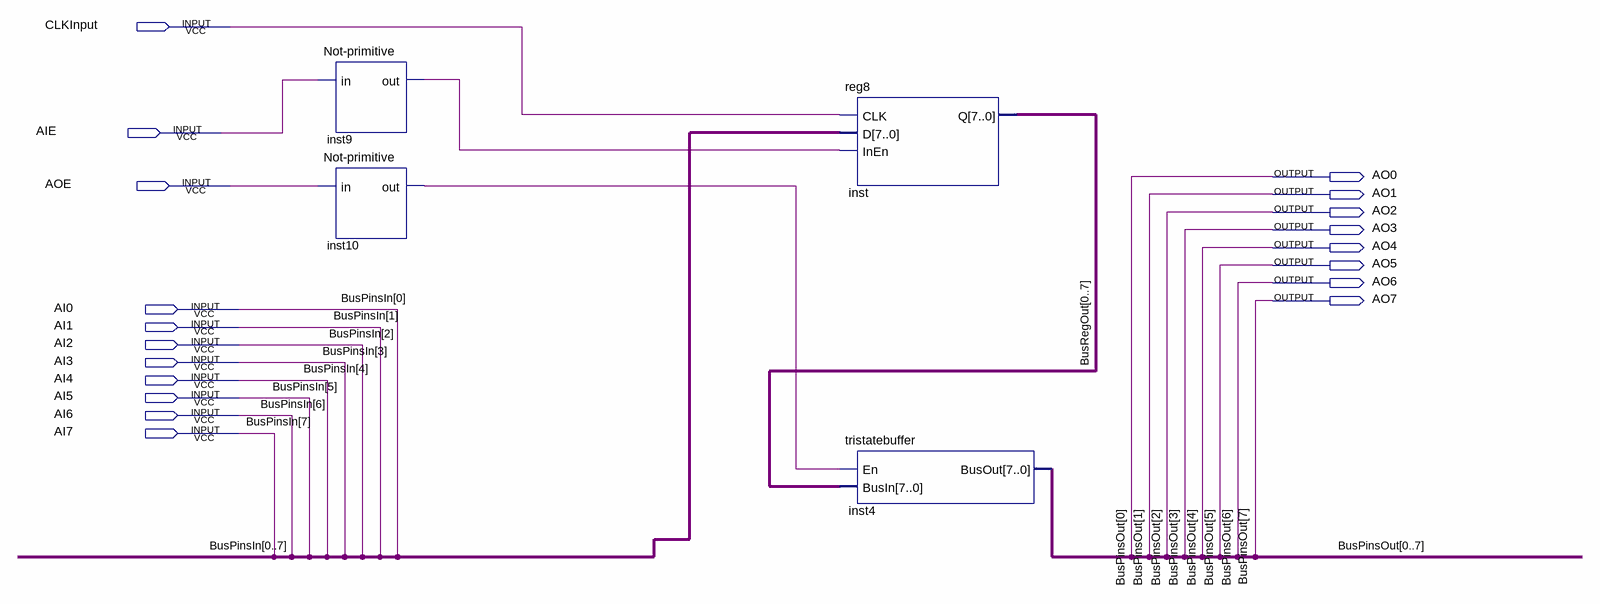
[diagram p0: schematic sheet]
// Quartus schematic 8-Bit-Computer.bdf as structural Verilog: 4 symbols, 19 pins
module \8-Bit-Computer  (
  input  CLKInput,
  input  AIE,
  input  AOE,
  input  AI0,
  input  AI1,
  input  AI2,
  input  AI3,
  input  AI4,
  input  AI5,
  input  AI6,
  input  AI7,
  output AO0,
  output AO1,
  output AO2,
  output AO3,
  output AO4,
  output AO5,
  output AO6,
  output AO7
);

  wire inst9_out, inst10_out;
  wire [7:0] BusRegOut;

  \Not-primitive  inst9 (.in(AIE), .out(inst9_out));
  \Not-primitive  inst10 (.in(AOE), .out(inst10_out));
  reg8 inst (
    .CLK(CLKInput), .D({AI0, AI1, AI2, AI3, AI4, AI5, AI6, AI7}), .InEn(inst9_out),
    .Q({BusRegOut[0], BusRegOut[1], BusRegOut[2], BusRegOut[3], BusRegOut[4], BusRegOut[5], BusRegOut[6], BusRegOut[7]}));
  tristatebuffer inst4 (
    .En(inst10_out),
    .BusIn({BusRegOut[0], BusRegOut[1], BusRegOut[2], BusRegOut[3], BusRegOut[4], BusRegOut[5], BusRegOut[6], BusRegOut[7]}),
    .BusOut({AO0, AO1, AO2, AO3, AO4, AO5, AO6, AO7}));

  // Other names for the same wires on the sheet: BusPinsOut[7:0] = {AO7, AO6, AO5, AO4, AO3, AO2, AO1, AO0};
  //   BusPinsIn[7:0] = {AI7, AI6, AI5, AI4, AI3, AI2, AI1, AI0}
endmodule
